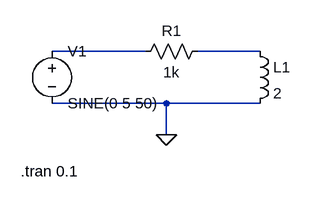
[diagram p0: schematic LR Series with Sine wave.asc]
LR Series with Sine wave.asc, the LTspice schematic file:
Version 4
SHEET 1 880 680
WIRE 256 144 112 144
WIRE 432 144 336 144
WIRE 288 224 112 224
WIRE 432 224 288 224
WIRE 288 272 288 224
FLAG 288 272 0
SYMBOL res 352 128 R90
WINDOW 0 0 56 VBottom 2
WINDOW 3 32 56 VTop 2
SYMATTR InstName R1
SYMATTR Value 1k
SYMBOL ind 416 128 R0
SYMATTR InstName L1
SYMATTR Value 2
SYMBOL voltage 112 128 R0
WINDOW 123 0 0 Left 0
WINDOW 39 0 0 Left 0
SYMATTR InstName V1
SYMATTR Value SINE(0 5 50)
TEXT 64 328 Left 2 !.tran 0.1

The netlist it stands for:
* LR Series with Sine wave.asc
R1 N002 N001 1k
L1 N002 0 2
V1 N001 0 SINE(0 5 50)
.tran 0.1
.backanno
.end